# Altium schematic sheet Power.SchDoc
size A4; SheetNumber: 4; SheetTotal: 4
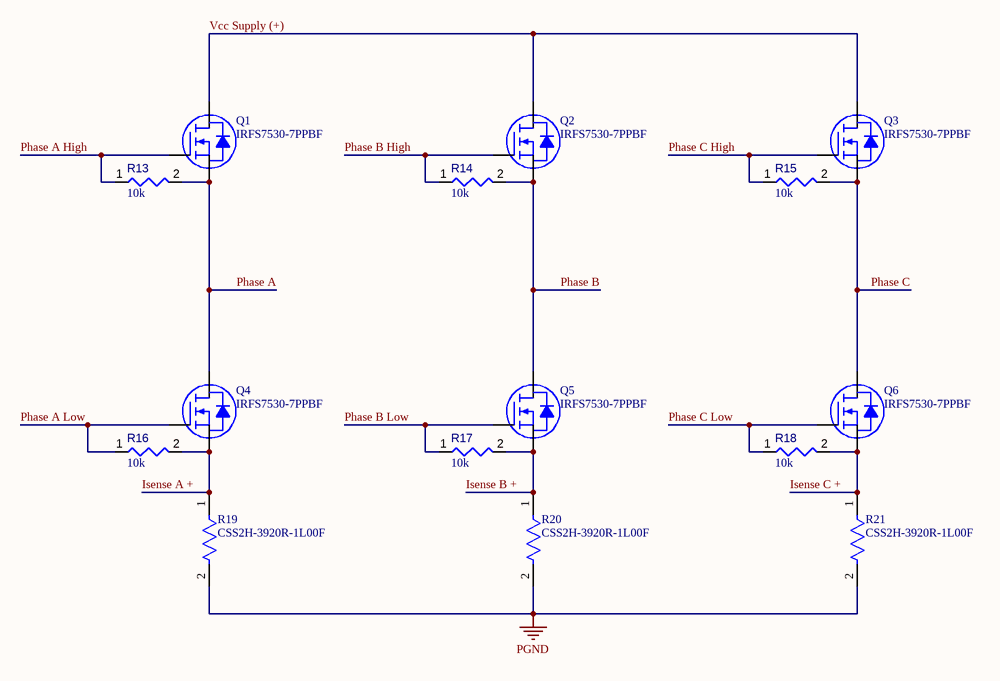
[diagram p0: Power.SchDoc]

## Parts
Q1  IRFS7530-7PPBF  [INFINEON TO-263-7]
Q2  IRFS7530-7PPBF  [INFINEON TO-263-7]
Q3  IRFS7530-7PPBF  [INFINEON TO-263-7]
Q4  IRFS7530-7PPBF  [INFINEON TO-263-7]
Q5  IRFS7530-7PPBF  [INFINEON TO-263-7]
Q6  IRFS7530-7PPBF  [INFINEON TO-263-7]
R13  value 10k  [RESA60-630X240]  (hidden comment: MFR-25FBF52-10K)
R14  value 10k  [RESA60-630X240]  (hidden comment: MFR-25FBF52-10K)
R15  value 10k  [RESA60-630X240]  (hidden comment: MFR-25FBF52-10K)
R16  value 10k  [RESA60-630X240]  (hidden comment: MFR-25FBF52-10K)
R17  value 10k  [RESA60-630X240]  (hidden comment: MFR-25FBF52-10K)
R18  value 10k  [RESA60-630X240]  (hidden comment: MFR-25FBF52-10K)
R19  CSS2H-3920R-1L00F  [FP-CSS2H-3920R-1L00F-MFG]
R20  CSS2H-3920R-1L00F  [FP-CSS2H-3920R-1L00F-MFG]
R21  CSS2H-3920R-1L00F  [FP-CSS2H-3920R-1L00F-MFG]

## Nets
PGND: R19.2 R20.2 R21.2
Isense A +: Q4.2(S) Q4.3(S) Q4.5(S) Q4.6(S) Q4.7(S) R16.2 R19.1
Isense B +: Q5.2(S) Q5.3(S) Q5.5(S) Q5.6(S) Q5.7(S) R17.2 R20.1
Isense C +: Q6.2(S) Q6.3(S) Q6.5(S) Q6.6(S) Q6.7(S) R18.2 R21.1
Phase A: Q1.2(S) Q1.3(S) Q1.5(S) Q1.6(S) Q1.7(S) Q4.8(D) R13.2
Phase A High: Q1.1(G) R13.1
Phase A Low: Q4.1(G) R16.1
Phase B: Q2.2(S) Q2.3(S) Q2.5(S) Q2.6(S) Q2.7(S) Q5.8(D) R14.2
Phase B High: Q2.1(G) R14.1
Phase B Low: Q5.1(G) R17.1
Phase C: Q3.2(S) Q3.3(S) Q3.5(S) Q3.6(S) Q3.7(S) Q6.8(D) R15.2
Phase C High: Q3.1(G) R15.1
Phase C Low: Q6.1(G) R18.1
Vcc Supply (+): Q1.8(D) Q2.8(D) Q3.8(D)

## Library data of the parts
Q1-Q6 = IRFS7530TRL7PP: MOSFET N CH 60V 240A D2PAK; Manufacturer: Infineon Technologies; Current - Continuous Drain (Id) @ 25°C: 240A (Tc); Drive Voltage (Max Rds On,  Min Rds On): 6V, 10V; FET Type: N-Channel; Gate Charge (Qg) (Max) @ Vgs: 354 nC @ 10 V; Input Capacitance (Ciss) (Max) @ Vds: 12960 pF @ 25 V; Power Dissipation (Max): 375W (Tc); Rds On (Max) @ Id, Vgs: 1.4mOhm @ 100A, 10V; Vgs (Max): ±20V; Vgs(th) (Max) @ Id: 3.7V @ 250µA; Part Number: IRFS7530TRL7PP; ComponentLink1Description: Datasheet; ComponentLink1URL: https://www.infineon.com/dgdl/irfs7530-7ppbf.pdf?fileId=5546d462533600a40153563a9d1e21d8; ComponentLink2Description: DigiKey Link; ComponentLink2URL: https://www.digikey.com/en/products/detail/infineon-technologies/IRFS7530TRL7PP/4772498; Drain to Source Voltage (Vdss): 60 V; LastUpdated: 01/04/2026 21:01:32; Lifecycle Status: Active; Minimum Order: 1; Mounting Type: Surface Mount; Operating Temperature: -55°C ~ 175°C (TJ); Package / Case: TO-263-7, D²Pak (6 Leads + Tab); Packaging: TapeAndReel; Part Status: Active; Price: 1.59; Series: HEXFET®, StrongIRFET™; Supplier 1: DigiKey; Supplier Part Number 1: IRFS7530TRL7PPCT-ND; Supplier Device Package: PG-TO263-7; Technology: MOSFET (Metal Oxide)
R13-R18 = CMP-009-00048-4: 10 kOhms ±1% 0.25W, 1/4W Through Hole Resistor Axial Metal Film; Manufacturer: Yageo; Voltage Rating: 250V; Power: 250mW; Min Operating Temperature: -55°C; Max Operating Temperature: 155°C; Tolerance: 1%; Package Reference: MFR-25; Composition: CarbonFilm; Mounting Technology: TH; Packaging: Bulk; Case/Package: Axial; Datasheet URL: http://www.yageo.com/documents/recent/Yageo%20LR_MFR_2013.pdf; Package Quantity: 200; Manufacturer URL: http://www.yageo.com/; Package Description: 2-Pin Axial Lead, Dia 2.4 mm, Body Length 6.3 mm; Datasheet Version: Apr-13; RoHS Compliant: True
R19-R21 = CMP-07231-006016-1: RES 0.001 OHM 1% 8W 3920; Temperature Coefficient: 50ppm/°C; Resistance: 1mR; Length: 0.394inch; Height: 0.02inch; RoHS Compliant: Yes; Packaging: Cut Tape; Case/Package: 3920; Width: 0.205inch; Features: Moisture Resistant; Case Code (Imperial): 3920; Case Code (Metric): 1052; Min Operating Temperature: -55°C; Tolerance: 1%; Power Rating: 8W; Resistor Type: Metal Element; Max Power Dissipation: 8W; REACH SVHC: No SVHC; Max Operating Temperature: 170°C; Number of Terminations: 2